# Altium schematic sheet TMP235AQDB2TQ1.SchDoc
size A
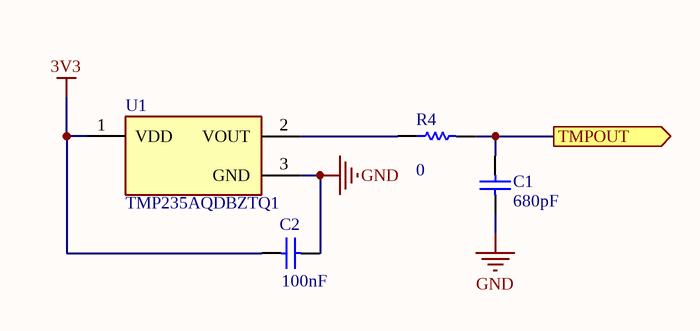
[diagram p0: TMP235AQDB2TQ1.SchDoc]

## Parts
C1  value 680pF  [1608[0603]]  (hidden comment: Cap)
C2  value 100nF  [1608[0603]]  (hidden comment: Cap)
R4  value 0  [0402-A]  (hidden comment: Res1)
U1  TMP235AQDBZTQ1  [FP-DBZ0003A-MFG]

## Ports
TMPOUT (out)

## Nets
3V3: C2.1 U1.1(VDD)
GND: C1.2 C2.2 U1.3(GND)
TMPOUT: C1.1 R4.2 ; port TMPOUT
NetR4_1: R4.1 U1.2(VOUT)

## Library data of the parts
C1 C2 = Cap: Capacitor; Published: 8-Jun-2000; LatestRevisionDate: 17-Jul-2002; LatestRevisionNote: Re-released for DXP Platform.; PackageReference: RAD-0.3; Publisher: Altium Limited; PackageDescription: Radial Cap, Thru-Hole; 2 Leads; 0.3 in Pin Spacing
R4 = Res1: Resistor; Published: 8-Jun-2000; LatestRevisionDate: 17-Jul-2002; LatestRevisionNote: Re-released for DXP Platform.; PackageReference: AXIAL-0.3; Publisher: Altium Limited; PackageDescription: Axial Device, Thru-Hole; 2 Leads; 0.3 in Pin Spacing
U1 = CMP-04948-000003-1: LOW-POWER HIGH-ACCURACY ANALOG O; Manufacturer: Texas Instruments; Manufacturer Part Number: TMP235A2DBZR; Output Current: 500uA; Operating Supply Current: 9uA; Max Supply Voltage: 5.5V; Max Junction Temp: +150°C; Accuracy: 0.5%; Min Supply Voltage: 2.3V; Standoff Height: 0.01mm; Sensor Output: Analog Voltage; Ambient Temperature Range Low: -40°C; Device Class L2: Temperature and Humidity Sensors; Digikey Description: LOW-POWER HIGH-ACCURACY ANALOG O; Lead Free: Yes; Category: IC; Device Class L3: unset; Temperature Range Low: -40°C; ComponentLink2Description: Datasheet; Package: DBZ0003A; Octopart: https://octopart.com/tmp235a2dbzr-texas+instruments-94966376; Device Class L1: Sensors; Temperature Range High: +150°C; Height: 1.12mm; Temperature: -40°C to +150°C; RoHS: TRUE; Ambient Temperature Range High: +150°C; Automotive: No; ComponentLink2URL: http://www.ti.com/lit/ds/symlink/tmp235.pdf; Mouser Description: ±2°C Analog output temperature sensor, with 10mV /°C gain 3-SOT-23 -40 to 150